# EAGLE design working (EAGLE 9.0.0)
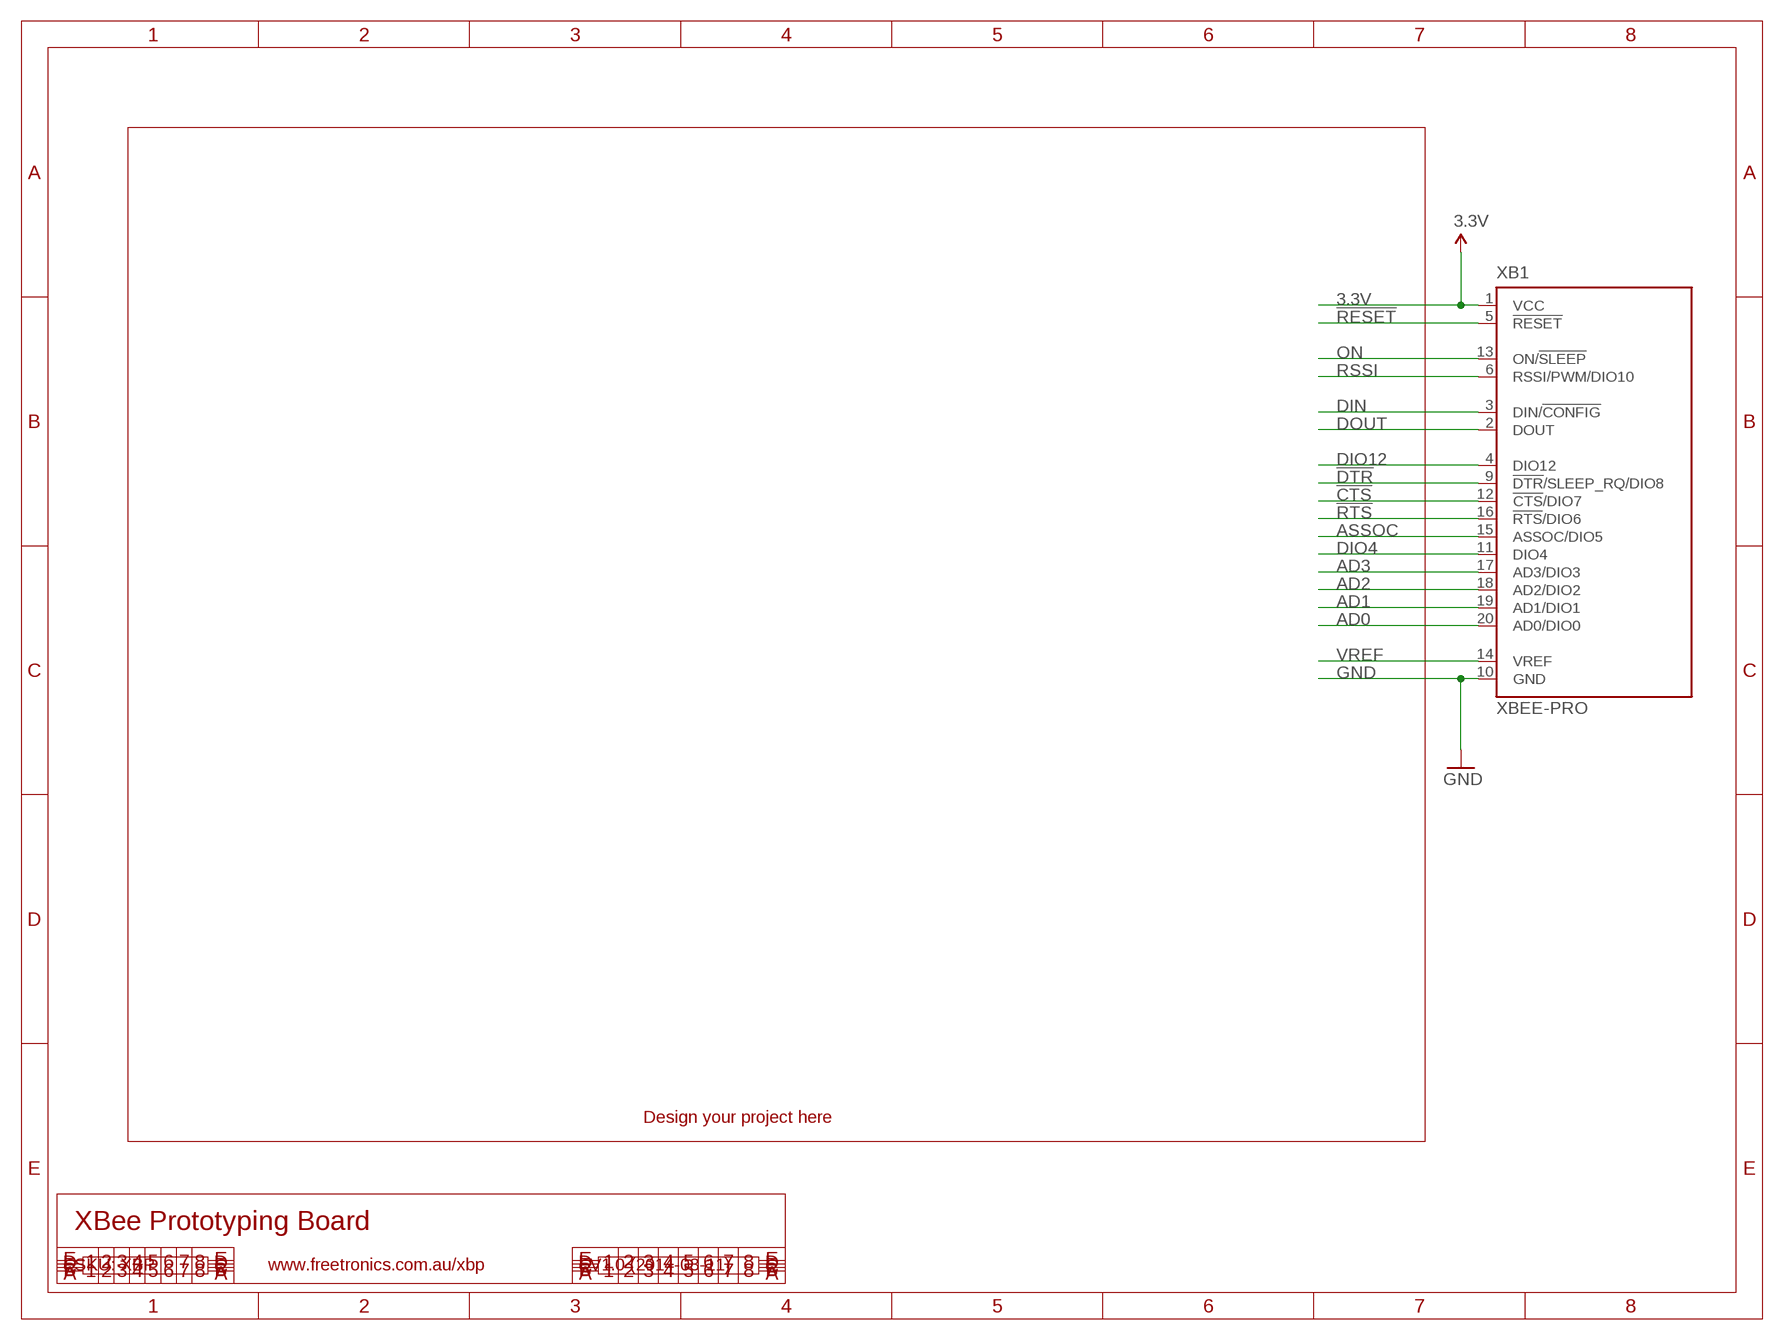
[diagram p0: schematic, sheet 1]

## Parts
XB1  XBEE-PRO  [XBEE-PRO]

## Nets
3.3V: XB1.1(VCC)
!CTS: XB1.12(!CTS!/DIO7)
!DTR: XB1.9(!DTR!/SLEEP_RQ/DIO8)
!RESET: XB1.5(!RESET)
!RTS: XB1.16(!RTS!/DIO6)
AD0: XB1.20(AD0/DIO0)
AD1: XB1.19(AD1/DIO1)
AD2: XB1.18(AD2/DIO2)
AD3: XB1.17(AD3/DIO3)
ASSOC: XB1.15(ASSOC/DIO5)
DIN: XB1.3(DIN/!CONFIG)
DIO4: XB1.11(DIO4)
DIO12: XB1.4(DIO12)
DOUT: XB1.2(DOUT)
GND: XB1.10(GND)
ON: XB1.13(ON/!SLEEP)
RSSI: XB1.6(RSSI/PWM/DIO10)
VREF: XB1.14(VREF)

## Notes on the sheet
- Design your project here
- XBee Prototyping Board
- SKU: XBP | www.freetronics.com.au/xbp | V1.0 (2014-03-11)

## Library data of the parts
XB1 = freetronics-jon:XBEE: XBee (TM) /XBee-PRO(TM) OEM RF Modules Source: MaxStream, Inc. xbee_productmanual.pdf; MPN: XBP24-AWI-001; OC_FARNELL: 1337916; OC_NEWARK: 42M2667

## Net classes
0 Default: width 0.203 mm
1 VCC: width 0.305 mm

## Board
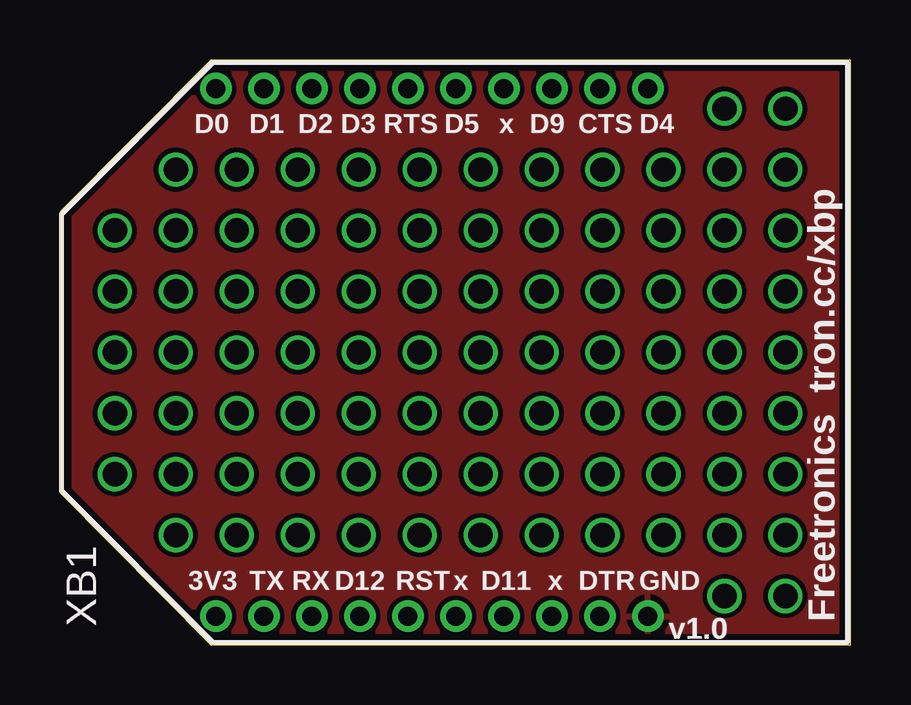
[diagram p1: board, top side]
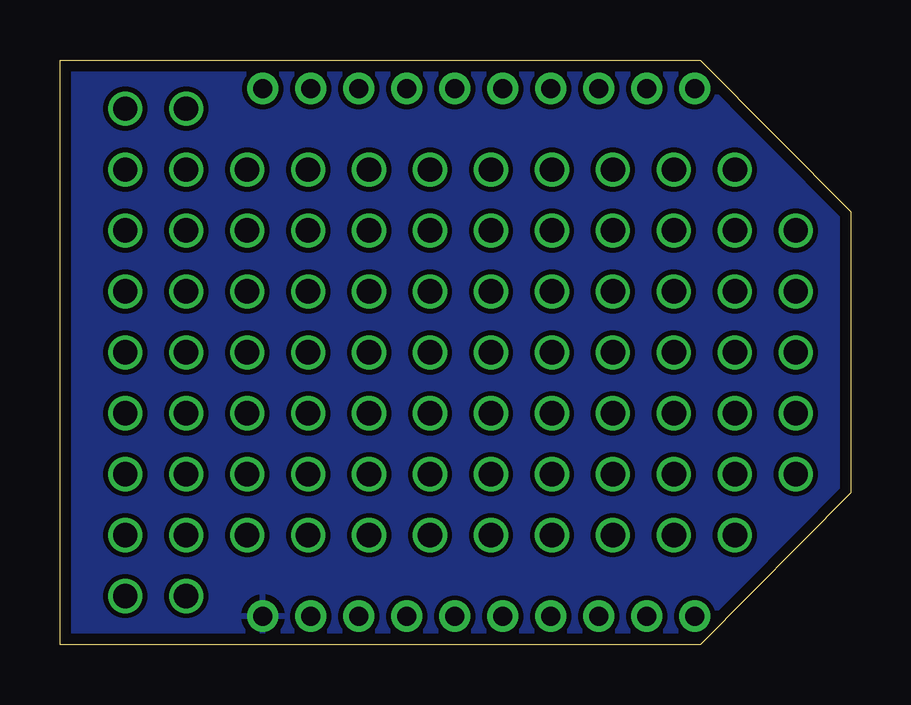
[diagram p2: board, bottom side, seen from below]

Size 32.94 x 24.38 mm. Coordinates in mm from the lower left corner, seen from the top.
Outline: 0,6.33 6.27,0 32.94,0 32.94,24.38 6.27,24.38 0,18.06 0,6.33
Copper layers (1*16): Top 0.035mm / dielectric 1.5mm / Bottom 0.035mm
Design rules "default": minimum track width 8mil, minimum drill 15mil, track to track 8mil, track to pad 8mil, pad to pad 8mil, via to via 8mil, smd to smd 8mil, copper to edge 18mil, drill to drill 8mil, minimum pad ring 10mil, minimum via ring 6mil, stop-mask expansion 4mil, vias tented up to drill 25mil, thermal gap 10mil

### Footprints (pad centres in the part's own frame; a part is rotated, then mirrored left to right if it is on the bottom)
XBEE-PRO = drill 0.8 pad 1.27: 1 -11,9; 2 -11,7; 3 -11,5; 4 -11,3; 5 -11,1; 6 -11,-1; 7 -11,-3; 8 -11,-5; 9 -11,-7; 10 -11,-9; 11 11,-9; 12 11,-7; 13 11,-5; 14 11,-3; 15 11,-1; 16 11,1; 17 11,3; 18 11,5; 19 11,7; 20 11,9

### Placement (x,y rotation side)
XB1  15.49,12.19 90 top

### Tracks (layer width: path | path; a pad name or v marks a point on that pad's centre or on a via)
GND
  pour Bottom: 0,6.32 0,18.06 6.27,24.38 32.94,24.38 32.94,0 6.27,0
  pour Top: 0,6.32 0,18.06 6.27,24.38 32.94,24.38 32.94,0 6.27,0
N$1  (via drill 1.02)
  other vias: 7.37,17.27
N$2  (via drill 1.02)
  other vias: 9.91,17.27
N$3  (via drill 1.02)
  other vias: 12.45,17.27
N$4  (via drill 1.02)
  other vias: 14.99,17.27
N$5  (via drill 1.02)
  other vias: 17.53,17.27
N$6  (via drill 1.02)
  other vias: 20.07,17.27
N$7  (via drill 1.02)
  other vias: 22.61,17.27
N$8  (via drill 1.02)
  other vias: 25.15,17.27
N$9  (via drill 1.02)
  other vias: 25.15,14.73
N$11  (via drill 1.02)
  other vias: 22.61,14.73
N$12  (via drill 1.02)
  other vias: 20.07,14.73
N$13  (via drill 1.02)
  other vias: 17.53,14.73
N$14  (via drill 1.02)
  other vias: 14.99,14.73
N$15  (via drill 1.02)
  other vias: 12.45,14.73
N$16  (via drill 1.02)
  other vias: 9.91,14.73
N$17  (via drill 1.02)
  other vias: 7.37,14.73
N$18  (via drill 1.02)
  other vias: 4.83,14.73
N$19  (via drill 1.02)
  other vias: 4.83,17.27
N$20  (via drill 1.02)
  other vias: 2.29,14.73
N$21  (via drill 1.02)
  other vias: 2.29,12.19
N$22  (via drill 1.02)
  other vias: 2.29,9.65
N$24  (via drill 1.02)
  other vias: 2.29,7.11
N$25  (via drill 1.02)
  other vias: 2.29,17.27
N$26  (via drill 1.02)
  other vias: 4.83,12.19
N$27  (via drill 1.02)
  other vias: 7.37,12.19
N$28  (via drill 1.02)
  other vias: 9.91,12.19
N$29  (via drill 1.02)
  other vias: 12.45,12.19
N$30  (via drill 1.02)
  other vias: 14.99,12.19
N$31  (via drill 1.02)
  other vias: 17.53,12.19
N$32  (via drill 1.02)
  other vias: 20.07,12.19
N$33  (via drill 1.02)
  other vias: 22.61,12.19
N$34  (via drill 1.02)
  other vias: 25.15,12.19
N$35  (via drill 1.02)
  other vias: 25.15,9.65
N$36  (via drill 1.02)
  other vias: 22.61,9.65
N$37  (via drill 1.02)
  other vias: 20.07,9.65
N$38  (via drill 1.02)
  other vias: 17.53,9.65
N$39  (via drill 1.02)
  other vias: 14.99,9.65
N$40  (via drill 1.02)
  other vias: 12.45,9.65
N$41  (via drill 1.02)
  other vias: 9.91,9.65
N$42  (via drill 1.02)
  other vias: 7.37,9.65
N$43  (via drill 1.02)
  other vias: 4.83,9.65
N$44  (via drill 1.02)
  other vias: 4.83,7.11
N$45  (via drill 1.02)
  other vias: 7.37,7.11
N$46  (via drill 1.02)
  other vias: 9.91,7.11
N$47  (via drill 1.02)
  other vias: 12.45,7.11
N$48  (via drill 1.02)
  other vias: 14.99,7.11
N$49  (via drill 1.02)
  other vias: 17.53,7.11
N$50  (via drill 1.02)
  other vias: 20.07,7.11
N$51  (via drill 1.02)
  other vias: 22.61,7.11
N$52  (via drill 1.02)
  other vias: 25.15,7.11
N$53  (via drill 1.02)
  other vias: 4.83,4.57
N$54  (via drill 1.02)
  other vias: 7.37,4.57
N$55  (via drill 1.02)
  other vias: 9.91,4.57
N$56  (via drill 1.02)
  other vias: 12.45,4.57
N$57  (via drill 1.02)
  other vias: 14.99,4.57
N$58  (via drill 1.02)
  other vias: 17.53,4.57
N$59  (via drill 1.02)
  other vias: 20.07,4.57
N$60  (via drill 1.02)
  other vias: 22.61,4.57
N$61  (via drill 1.02)
  other vias: 25.15,4.57
N$62  (via drill 1.02)
  other vias: 25.15,19.81
N$63  (via drill 1.02)
  other vias: 22.61,19.81
N$64  (via drill 1.02)
  other vias: 20.07,19.81
N$65  (via drill 1.02)
  other vias: 17.53,19.81
N$66  (via drill 1.02)
  other vias: 14.99,19.81
N$67  (via drill 1.02)
  other vias: 12.45,19.81
N$68  (via drill 1.02)
  other vias: 9.91,19.81
N$69  (via drill 1.02)
  other vias: 7.37,19.81
N$70  (via drill 1.02)
  other vias: 4.83,19.81
N$71  (via drill 1.02)
  other vias: 30.23,22.35
N$72  (via drill 1.02)
  other vias: 30.23,19.81
N$73  (via drill 1.02)
  other vias: 30.23,17.27
N$74  (via drill 1.02)
  other vias: 30.23,14.73
N$75  (via drill 1.02)
  other vias: 30.23,12.19
N$76  (via drill 1.02)
  other vias: 30.23,9.65
N$77  (via drill 1.02)
  other vias: 30.23,7.11
N$78  (via drill 1.02)
  other vias: 30.23,4.57
N$79  (via drill 1.02)
  other vias: 30.23,2.03
N$80  (via drill 1.02)
  other vias: 27.69,4.57
N$81  (via drill 1.02)
  other vias: 27.69,7.11
N$82  (via drill 1.02)
  other vias: 27.69,9.65
N$83  (via drill 1.02)
  other vias: 27.69,12.19
N$84  (via drill 1.02)
  other vias: 27.69,14.73
N$85  (via drill 1.02)
  other vias: 27.69,17.27
N$86  (via drill 1.02)
  other vias: 27.69,19.81
N$87  (via drill 1.02)
  other vias: 27.69,22.35
N$88  (via drill 1.02)
  other vias: 27.69,2.03

### Text on the board
tPlace: D0 | D1 | D2 | D3 | RTS | D5 | x | D9 | CTS | D4 | 3V3 | TX | RX | D12 | RST | x | D11 | x | DTR | GND | Freetronics tron.cc/xbp | v1.0